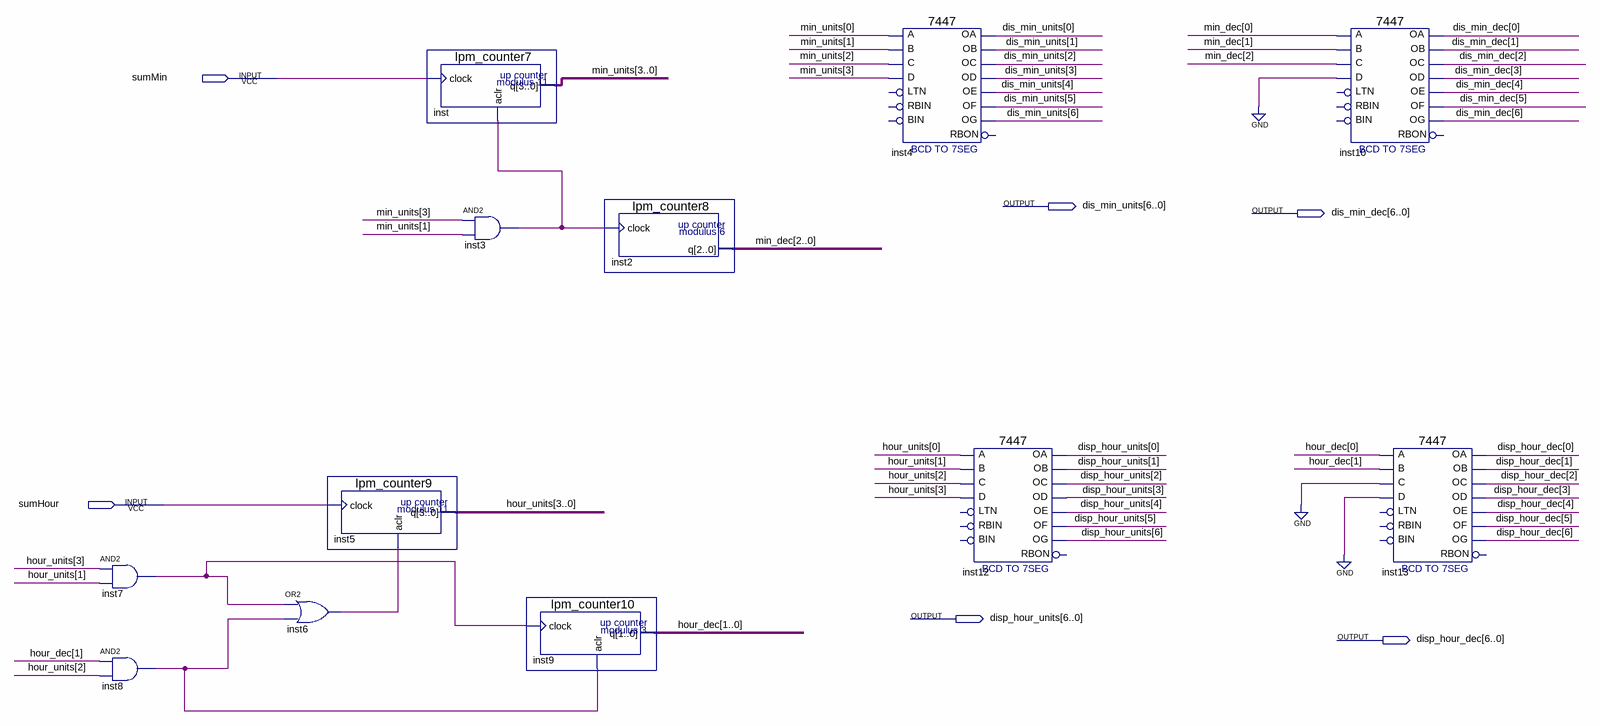
[diagram p0: schematic sheet]
// Quartus schematic Alarma.bdf as structural Verilog: 12 symbols, 6 pins
module Alarma (
  input  sumMin,
  input  sumHour,
  output [6:0] dis_min_units,
  output [6:0] dis_min_dec,
  output [6:0] disp_hour_units,
  output [6:0] disp_hour_dec
);

  wire inst3_out, inst6_out, inst7_out, inst8_out;
  wire [1:0] hour_dec;
  wire [2:0] min_dec;
  wire [3:0] hour_units, min_units;

  and inst7 (inst7_out, hour_units[3], hour_units[1]);
  and inst8 (inst8_out, hour_dec[1], hour_units[2]);
  or inst6 (inst6_out, inst7_out, inst8_out);
  lpm_counter9 inst5 (.clock(sumHour), .aclr(inst6_out), .q(hour_units));
  lpm_counter7 inst (.clock(sumMin), .aclr(inst3_out), .q(min_units));
  and inst3 (inst3_out, min_units[3], min_units[1]);
  lpm_counter10 inst9 (.clock(inst7_out), .aclr(inst8_out), .q(hour_dec));
  lpm_counter8 inst2 (.clock(inst3_out), .q(min_dec));
  \7447  inst4 (
    .B(min_units[1]), .C(min_units[2]), .D(min_units[3]), .A(min_units[0]), .OB(dis_min_units[1]),
    .OC(dis_min_units[2]), .OE(dis_min_units[4]), .OD(dis_min_units[3]), .OF(dis_min_units[5]),
    .OG(dis_min_units[6]), .OA(dis_min_units[0]));  // open: LTN, RBIN, BIN, RBON
  \7447  inst12 (
    .B(hour_units[1]), .C(hour_units[2]), .D(hour_units[3]), .A(hour_units[0]), .OB(disp_hour_units[1]),
    .OC(disp_hour_units[2]), .OE(disp_hour_units[4]), .OD(disp_hour_units[3]), .OF(disp_hour_units[5]),
    .OG(disp_hour_units[6]), .OA(disp_hour_units[0]));  // open: LTN, RBIN, BIN, RBON
  \7447  inst10 (
    .B(min_dec[1]), .C(min_dec[2]), .D(1'b0), .A(min_dec[0]), .OB(dis_min_dec[1]), .OC(dis_min_dec[2]),
    .OE(dis_min_dec[4]), .OD(dis_min_dec[3]), .OF(dis_min_dec[5]), .OG(dis_min_dec[6]), .OA(dis_min_dec[0]));  // open: LTN, RBIN, BIN, RBON
  \7447  inst13 (
    .B(hour_dec[1]), .C(1'b0), .D(1'b0), .A(hour_dec[0]), .OB(disp_hour_dec[1]), .OC(disp_hour_dec[2]),
    .OE(disp_hour_dec[4]), .OD(disp_hour_dec[3]), .OF(disp_hour_dec[5]), .OG(disp_hour_dec[6]),
    .OA(disp_hour_dec[0]));  // open: LTN, RBIN, BIN, RBON
endmodule
